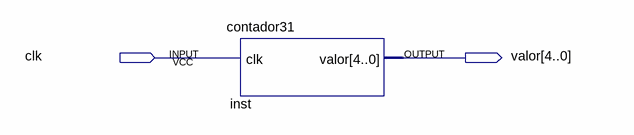
[diagram p0: schematic sheet]
// Quartus schematic contador_sincrono.bdf as structural Verilog: 1 symbols, 2 pins
module contador_sincrono (
  input  clk,
  output [4:0] valor
);

  contador31 inst (.clk(clk), .valor(valor));
endmodule
